# EAGLE design Template2310 (EAGLE 9.6.2)

## Sheet 1 of 2
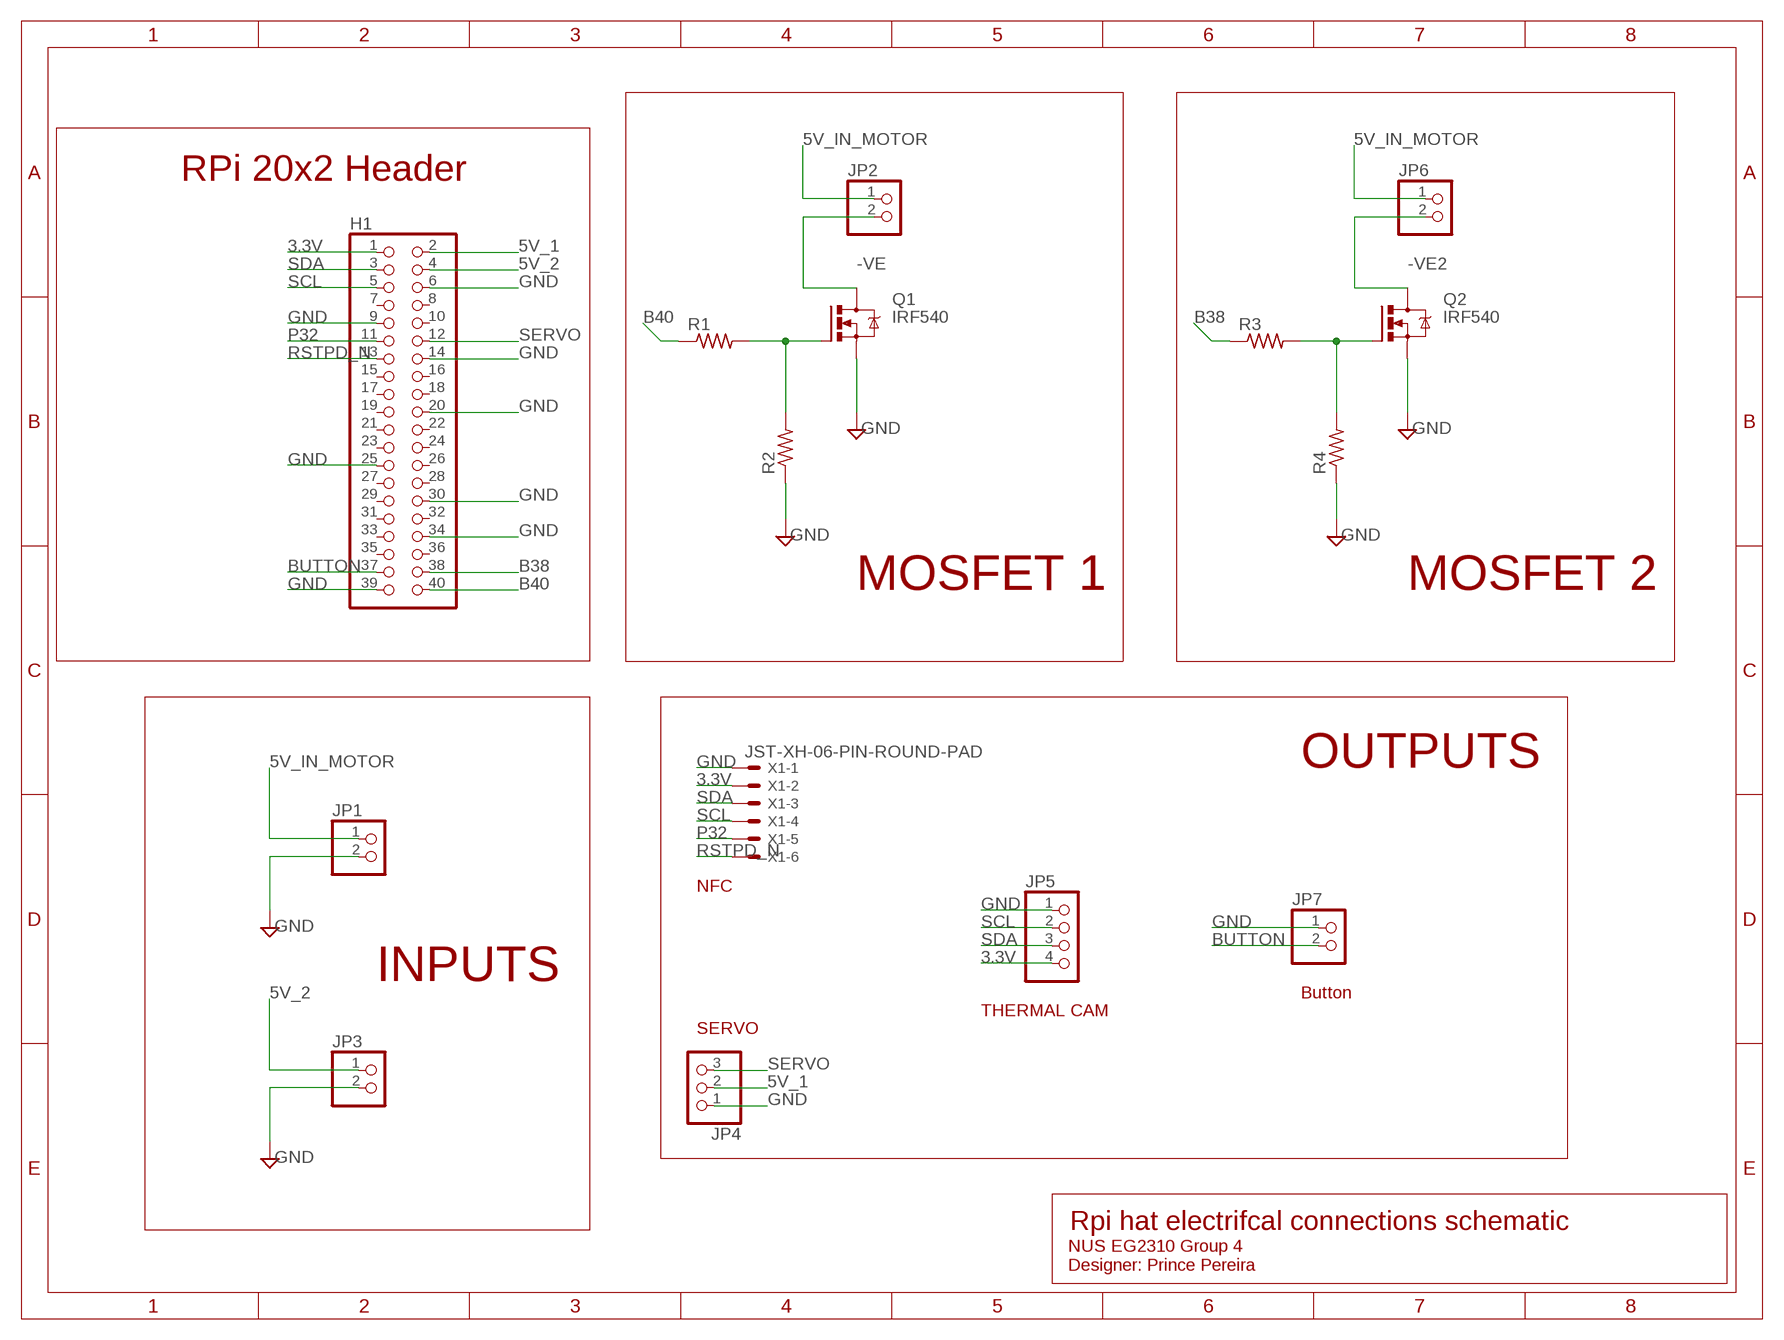
[diagram p0: schematic, sheet 1]

### Parts
H1  PINHD-2X20  [2X20]
JP1  PINHD-1X2  [1X02]
JP2  PINHD-1X2  [1X02]
JP3  PINHD-1X2  [1X02]
JP4  PINHD-1X3/90  [1X03/90]
JP5  PINHD-1X4/90  [1X04/90]
JP6  PINHD-1X2  [1X02]
JP7  PINHD-1X2/90  [1X02/90]
Q1  IRF540  [TO220BV]
Q2  IRF540  [TO220BV]
R1  R-US_0204/7  [0204/7]
R2  R-US_0204/7  [0204/7]
R3  R-US_0204/7  [0204/7]
R4  R-US_0204/7  [0204/7]
X1  JST-XH-06-PIN-ROUND-PAD  [JST-XH-06-PACKAGE-ROUND-PAD]

### Nets
3.3V: H1.1 JP5.4 X1.2
5V_1: H1.2 JP4.2
5V_2: H1.4 JP3.1
5V_IN_MOTOR: JP1.1 JP2.1 JP6.1
-VE: JP2.2 Q1.D
-VE2: JP6.2 Q2.D
B38: H1.38 R3.1
B40: H1.40 R1.1
BUTTON: H1.37 JP7.2
GND: H1.6 H1.9 H1.14 H1.20 H1.25 H1.30 H1.34 H1.39 JP1.2 JP3.2 JP4.1 JP5.1 JP7.1 Q1.S Q2.S R2.1 R4.1 X1.1
JUNCTION: Q1.G R1.2 R2.2
JUNCTION1: Q2.G R3.2 R4.2
P32: H1.11 X1.5
RSTPD_N: H1.13 X1.6
SCL: H1.5 JP5.2 X1.4
SDA: H1.3 JP5.3 X1.3
SERVO: H1.12 JP4.3
Unconnected: H1.7 H1.8 H1.10 H1.15 H1.16 H1.17 H1.18 H1.19 H1.21 H1.22 H1.23 H1.24 H1.26 H1.27 H1.28 H1.29 H1.31 H1.32 H1.33 H1.35 H1.36

### Notes on the sheet
- RPi 20x2 Header
- MOSFET 1 | MOSFET 2
- OUTPUTS
- NFC
- INPUTS
- Button
- THERMAL CAM
- SERVO
- Rpi hat electrifcal connections schematic
- NUS EG2310 Group 4
  Designer: Prince Pereira

## Sheet 2 of 2
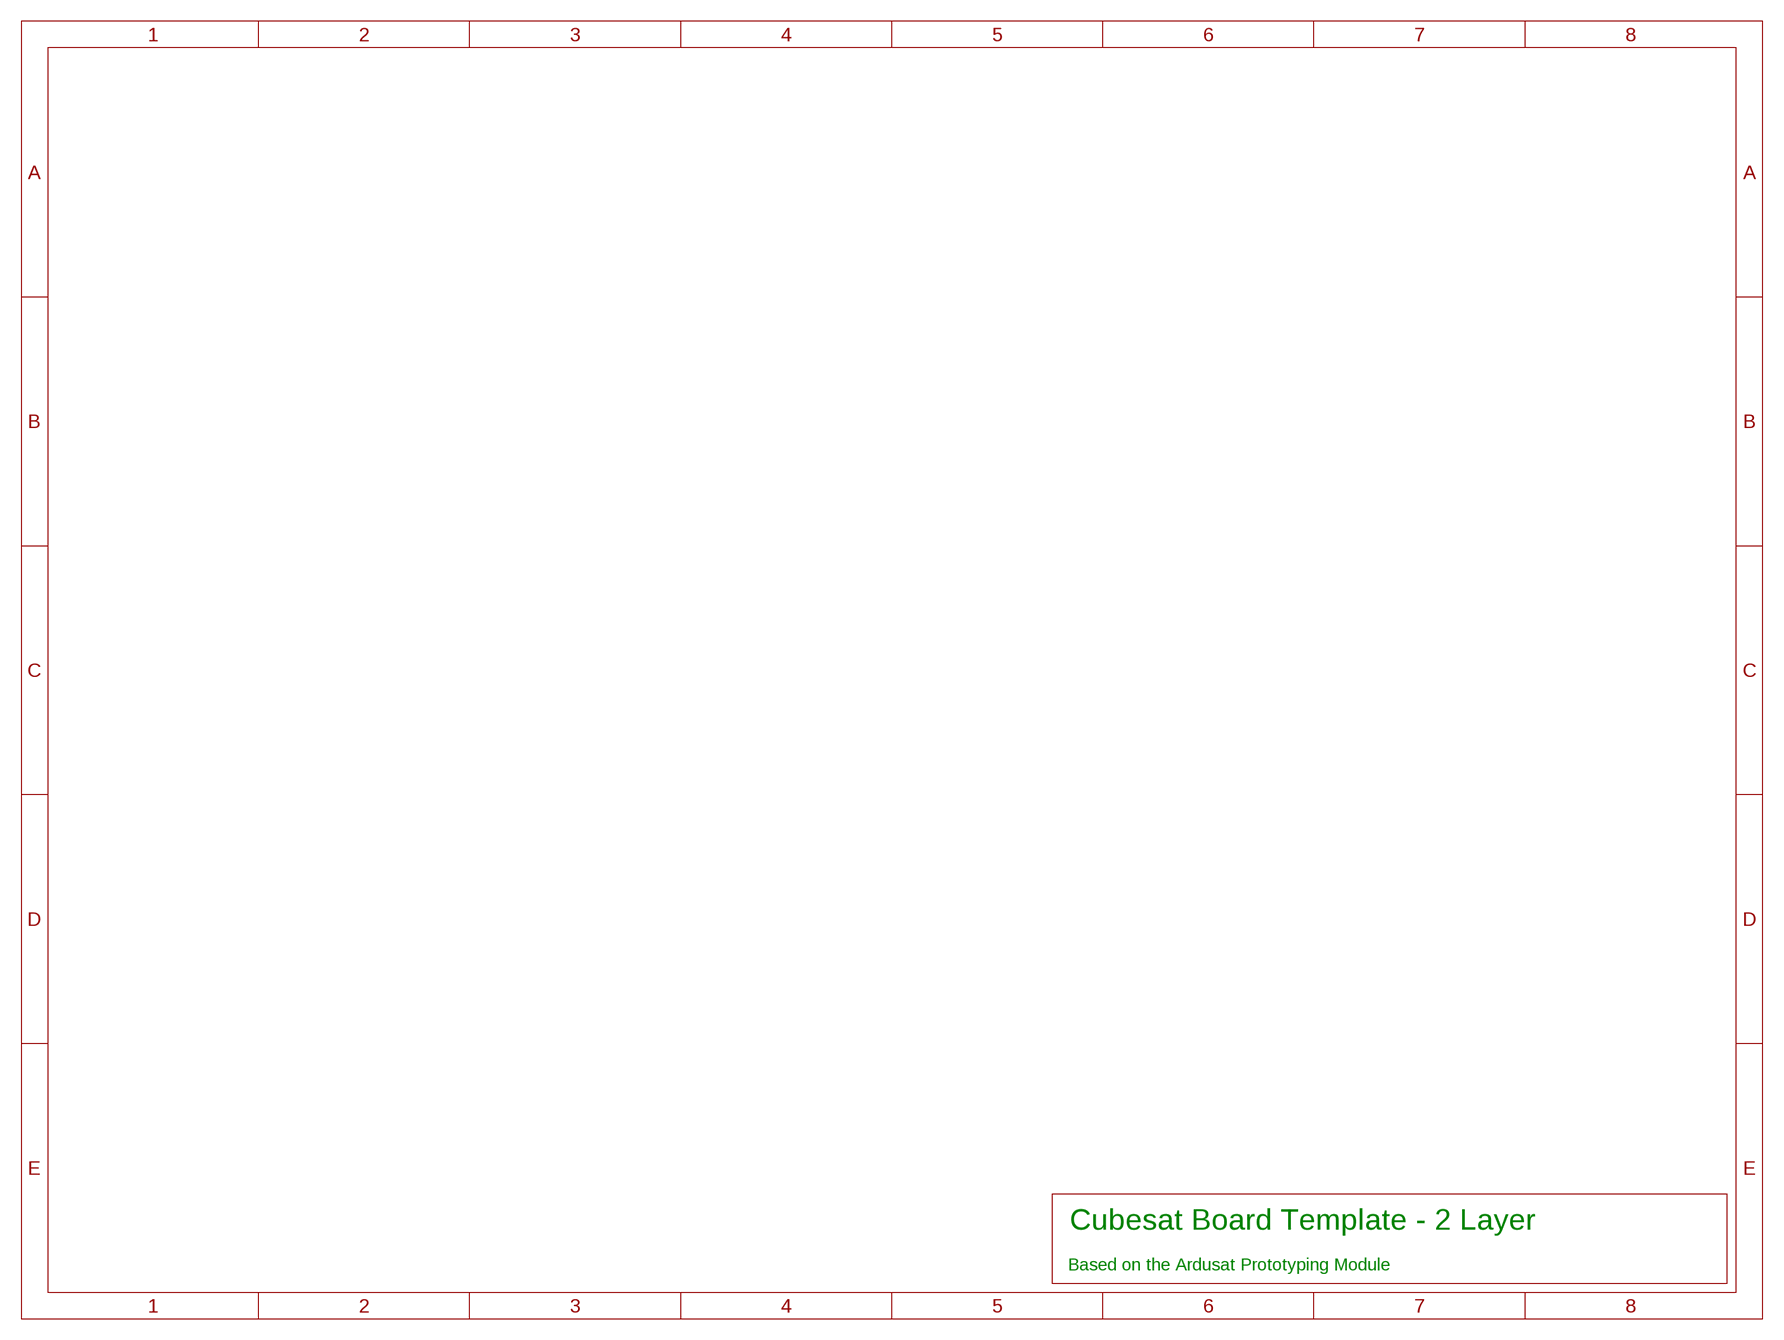
[diagram p1: schematic, sheet 2]

### Notes on the sheet
- Cubesat Board Template - 2 Layer
- Based on the Ardusat Prototyping Module

## Library data of the parts
H1 = pinhead:PINHD-2X20: PIN HEADER
JP1-JP3 JP6 JP7 = pinhead:PINHD-1X2: PIN HEADER
JP4 = pinhead:PINHD-1X3: PIN HEADER
JP5 = pinhead:PINHD-1X4: PIN HEADER
Q1 Q2 = transistor-power:IRF540: HEXFET Power MOSFET
R1-R4 = rcl:R-US_: RESISTOR, American symbol; SPICEPREFIX: R
X1 = Rembrandt Electronics - JST XH Connectors v1-0:JST-XH-06-PIN: JST XH Connector 2 Pin Wire to board connector. Pitch: 2,54 mm, (0.100") Number of pins: 6 Created by Rembrandt Electronics www.rembrandtelectronics.com

## Net classes
1 USB: width 0.203 mm, drill 0.406 mm, clearance 0.203 mm
3 usbvcc: width 0.203 mm, drill 0.406 mm, clearance 0.203 mm
4 USBpair: width 0.254 mm, drill 0.406 mm, clearance 0.61 mm

## Board
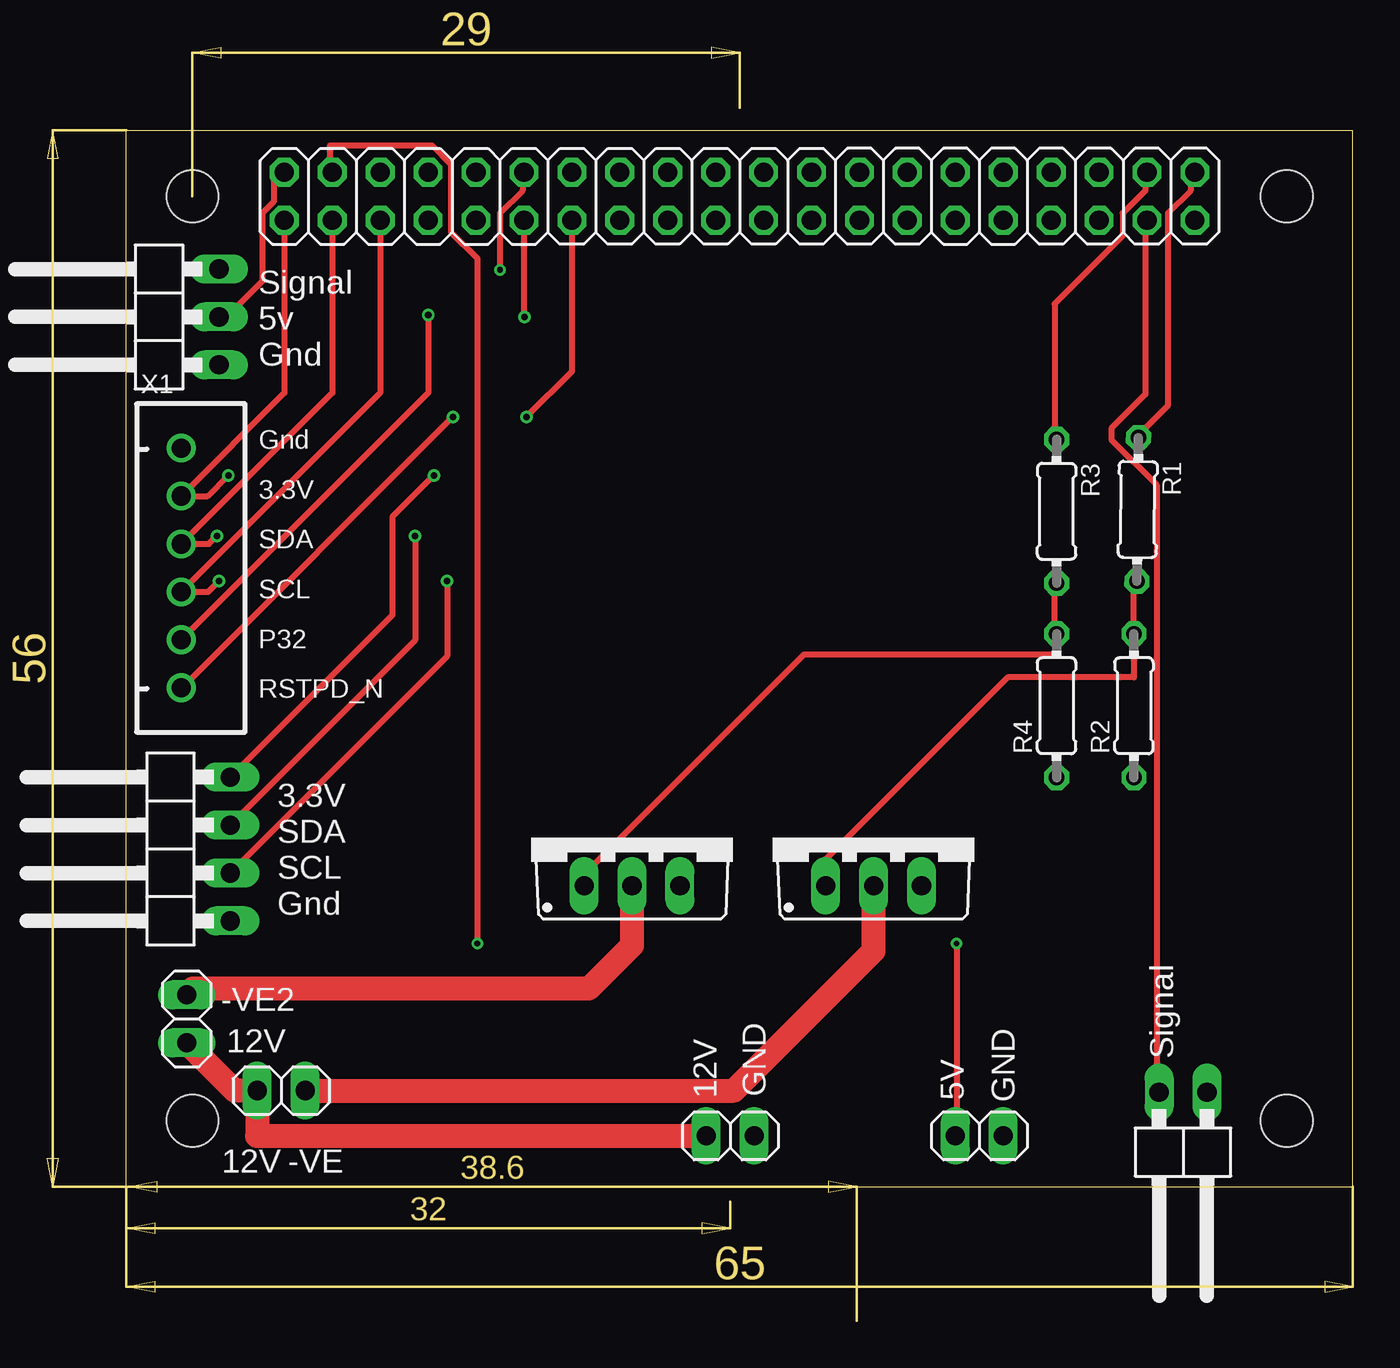
[diagram p2: board, top side]
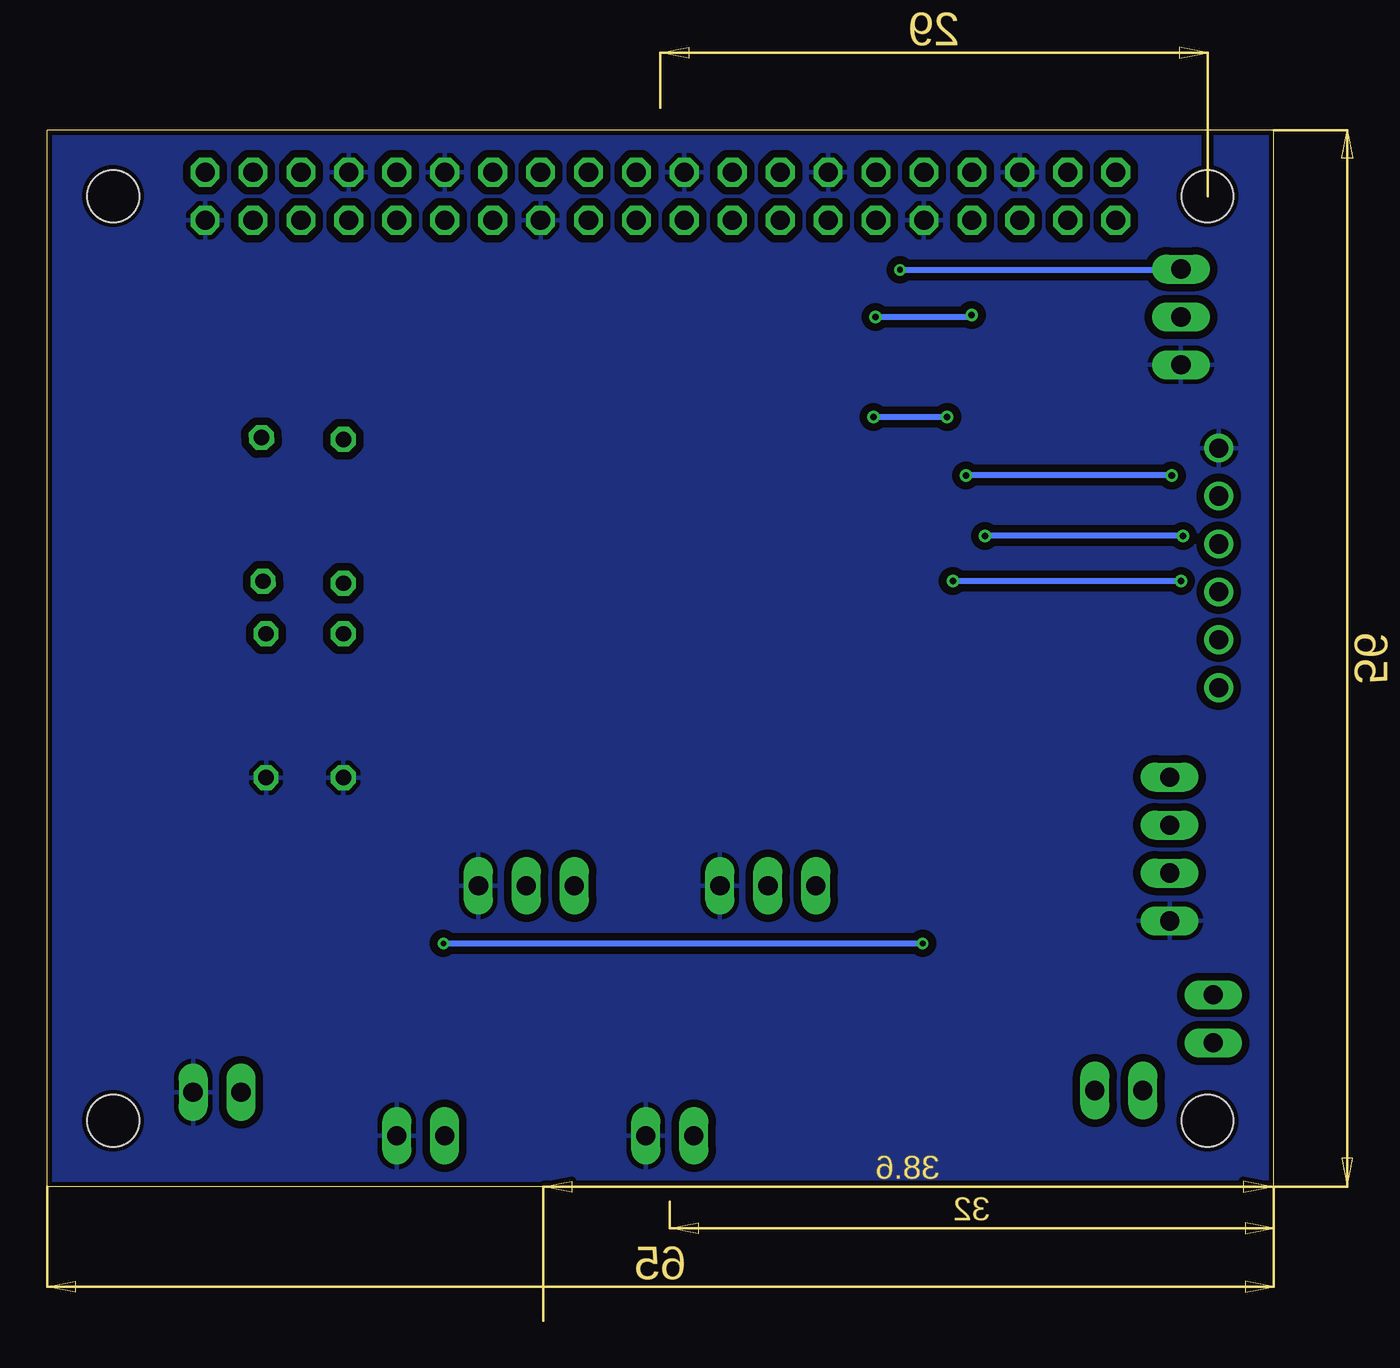
[diagram p3: board, bottom side, seen from below]

Size 65 x 56 mm. Coordinates in mm from the lower left corner, seen from the top.
Outline: 0,0 65,0 65,56 0,56 0,0
Copper layers (1*16): Top 0.035mm / dielectric 1.5mm / Bottom 0.035mm
Design rules "SeeedStudio_2layer_DRU_no_angle_20140221 *": minimum track width 12mil, minimum drill 12mil, track to track 16mil, track to pad 6mil, pad to pad 6mil, via to via 6mil, smd to smd 0mil, copper to edge 10mil, drill to drill 10mil, minimum pad ring 10mil, minimum via ring 6mil, stop-mask expansion 2mil, vias tented up to drill 100mil, thermal gap 10mil
Holes 2.75 mm at 3.5,3.5 61.5,3.5 61.5,52.5 3.5,52.5

### Footprints (pad centres in the part's own frame; a part is rotated, then mirrored left to right if it is on the bottom)
2X20 = drill 1.016 octagon: 1 -24.13,-1.27; 2 -24.13,1.27; 3 -21.59,-1.27; 4 -21.59,1.27; 5 -19.05,-1.27; 6 -19.05,1.27; 7 -16.51,-1.27; 8 -16.51,1.27; 9 -13.97,-1.27; 10 -13.97,1.27; 11 -11.43,-1.27; 12 -11.43,1.27; 13 -8.89,-1.27; 14 -8.89,1.27; 15 -6.35,-1.27; 16 -6.35,1.27; 17 -3.81,-1.27; 18 -3.81,1.27; 19 -1.27,-1.27; 20 -1.27,1.27; 21 1.27,-1.27; 22 1.27,1.27; 23 3.81,-1.27; 24 3.81,1.27; 25 6.35,-1.27; 26 6.35,1.27; 27 8.89,-1.27; 28 8.89,1.27; 29 11.43,-1.27; 30 11.43,1.27; 31 13.97,-1.27; 32 13.97,1.27; 33 16.51,-1.27; 34 16.51,1.27; 35 19.05,-1.27; 36 19.05,1.27; 37 21.59,-1.27; 38 21.59,1.27; 39 24.13,-1.27; 40 24.13,1.27
1X02 = drill 1.016 long: 1 -1.27,0; 2 1.27,0
1X03/90 = drill 1.016 long: 1 -2.54,-3.81; 2 0,-3.81; 3 2.54,-3.81
1X04/90 = drill 1.016 long: 1 -3.81,-3.81; 2 -1.27,-3.81; 3 1.27,-3.81; 4 3.81,-3.81
1X02/90 = drill 1.016 long: 1 -1.27,-3.81; 2 1.27,-3.81
TO220BV = drill 1.016 long: D 0,-2.54; G -2.54,-2.54; S 2.54,-2.54
0204/7 = drill 0.813 octagon: 1 -3.81,0; 2 3.81,0
JST-XH-06-PACKAGE-ROUND-PAD = drill 1.016: 1 -6.35,0; 2 -3.81,0; 3 -1.27,0; 4 1.27,0; 5 3.81,0; 6 6.35,0

### Placement (x,y rotation side)
H1  32.5,52.5 0 top
JP1  32,2.7 0 top
JP2  8.2,5.1 0 top
JP3  45.2,2.7 0 top
JP4  1.1,46.1 90 top
JP5  1.7,17.9 90 top
JP6  3.2,8.9 90 top
JP7  56,1.2 180 top
Q1  39.6,18.5 0 top
Q2  26.8,18.5 0 top
R1  53.6,35.9 269.4 top
R2  53.4,25.5 90 top
R3  49.3,35.8 270 top
R4  49.3,25.5 90 top
X1  2.9,32.8 270 top

### Tracks (layer width: path | path; a pad name or v marks a point on that pad's centre or on a via)
3.3V  (via drill 0.35)
  Top 0.305: H1.1 8.37,42.08 X1.2 4.31,36.61 v5.4,37.7 | v16.3,37.7 14.1,35.5 14.1,30.3 JP5.4
  Bottom 0.305: v5.4,37.7 v16.3,37.7
5V_1
  Top 0.305: JP4.2 5.4,46.2 7.2,48 7.2,51.6 7.8,52.2 7.8,53.4 H1.2
5V_2  (via drill 0.3)
  Top 0.305: v44,12.9 44,2.77 JP3.1 | v18.6,12.9 18.6,49.2 17.2,50.6 17.2,54.2 16.2,55.2 10.8,55.2 10.8,54 H1.4
  Bottom 0.305: v44,12.9 v18.6,12.9
5V_IN_MOTOR
  Top 1.27: JP1.1 6.93,2.7 JP2.1 5.73,5.1 JP6.1
-VE
  Top 1.27: JP2.2 32.2,5.1 39.6,12.5 Q1.D
-VE2
  Top 1.27: JP6.2 3.53,10.5 24.5,10.5 26.8,12.8 Q2.D
B38
  Top 0.305: R3.1 49.2,40.2 49.2,46.8 52.8,50.4 52.8,51.6 54,52.8 54,53.4 H1.38
B40
  Top 0.305: R1.1 54,40.2 55.2,41.4 55.2,51.6 56.4,52.8 56.4,53.4 H1.40
BUTTON
  Top 0.305: JP7.2 54.6,5.4 54.6,37.2 52.2,39.6 52.2,40.2 54,42 54,51 H1.37
GND
  pour Bottom: 0.1,55.9 65,55.9 65.1,55.8 65.1,0 0.1,0
JUNCTION
  Top 0.305: R1.2 53.4,31.8 R2.2 53.4,27 46.7,27 37.06,17.36 Q1.G
JUNCTION1
  Top 0.305: R3.2 49.2,31.8 49.2,29.4 R4.2 49.2,28.8 49.2,28.2 35.9,28.2 24.26,16.56 Q2.G
P32  (via drill 0.35)
  Top 0.305: H1.11 21.07,46.13 v21.1,46.1 | v16,46.2 16,42.09 X1.5
  Bottom 0.305: v21.1,46.1 16.1,46.1 v16,46.2
RSTPD_N  (via drill 0.35)
  Top 0.305: H1.13 23.61,43.21 v21.2,40.8 | v17.3,40.8 2.95,26.45 X1.6
  Bottom 0.305: v21.2,40.8 v17.3,40.8
SCL  (via drill 0.35)
  Top 0.305: H1.5 13.45,42.08 X1.4 4.33,31.53 v4.9,32.1 | v17,32.1 17,28.12 JP5.2
  Bottom 0.305: v4.9,32.1 v17,32.1
SDA  (via drill 0.35)
  Top 0.305: H1.3 10.91,42.08 X1.3 4.37,34.07 v4.8,34.5 | v15.3,34.5 15.3,28.96 JP5.3
  Bottom 0.305: v4.8,34.5 v15.3,34.5
SERVO  (via drill 0.3)
  Top 0.305: v19.8,48.6 19.8,51.6 21,52.8 21,53.4 H1.12
  Bottom 0.305: v19.8,48.6 5.4,48.6 JP4.3

### Text on the board
tNames: Signal / 5v / Gnd | Gnd / / 3.3V / / SDA / / SCL / / P32 / / RSTPD_N | 3.3V / SDA / SCL / Gnd | -VE2 | 12V | Signal | 12V | GND | 5V | GND | 12V | -VE